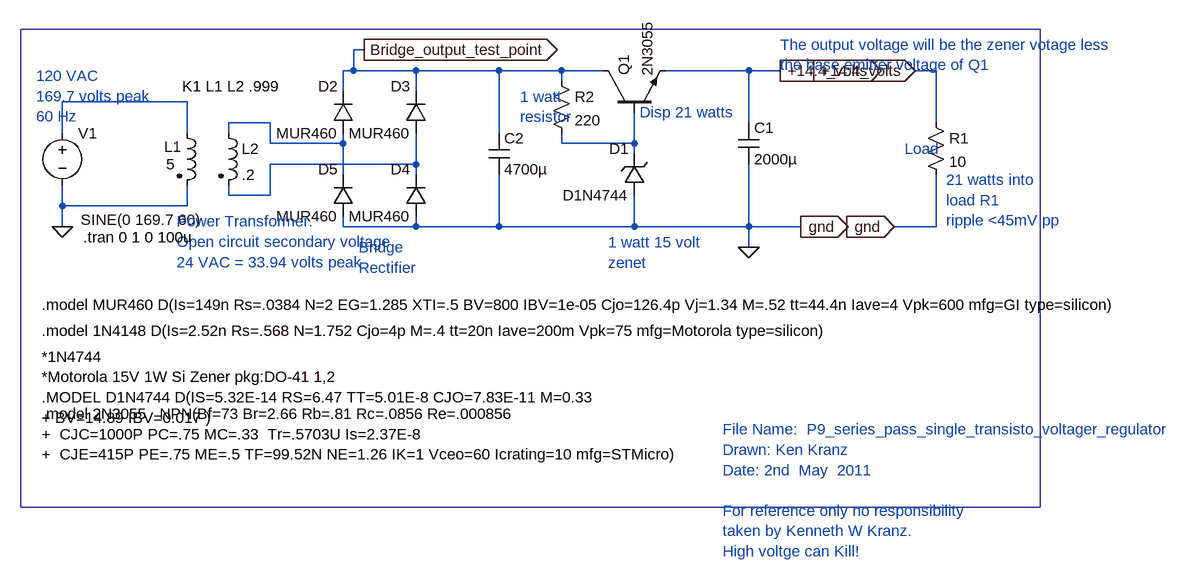
[diagram p0: schematic P9_Series_pass_single_transistor_regulator.asc]
P9_Series_pass_single_transistor_regulator.asc, the LTspice schematic file:
Version 4
SHEET 1 880 772
WIRE -1008 48 -1024 48
WIRE -1024 80 -1024 48
WIRE -1024 80 -1040 80
WIRE -928 80 -1024 80
WIRE -800 80 -928 80
WIRE -704 80 -800 80
WIRE -640 80 -704 80
WIRE -416 80 -544 80
WIRE -368 80 -416 80
WIRE -128 80 -160 80
WIRE -704 96 -704 80
WIRE -1040 112 -1040 80
WIRE -928 112 -928 80
WIRE -1280 128 -1472 128
WIRE -1152 160 -1216 160
WIRE -416 160 -416 80
WIRE -128 160 -128 80
WIRE -1472 176 -1472 128
WIRE -1280 176 -1280 128
WIRE -1216 176 -1216 160
WIRE -800 176 -800 80
WIRE -1152 192 -1152 160
WIRE -1040 192 -1040 176
WIRE -1040 192 -1152 192
WIRE -704 192 -704 176
WIRE -592 192 -592 144
WIRE -592 192 -704 192
WIRE -592 208 -592 192
WIRE -928 224 -928 176
WIRE -928 224 -1152 224
WIRE -1040 240 -1040 192
WIRE -928 240 -928 224
WIRE -1216 272 -1216 256
WIRE -1152 272 -1152 224
WIRE -1152 272 -1216 272
WIRE -1472 288 -1472 256
WIRE -1280 288 -1280 256
WIRE -1280 288 -1472 288
WIRE -1472 320 -1472 288
WIRE -1040 320 -1040 304
WIRE -928 320 -928 304
WIRE -928 320 -1040 320
WIRE -800 320 -800 240
WIRE -800 320 -928 320
WIRE -592 320 -592 272
WIRE -592 320 -800 320
WIRE -416 320 -416 224
WIRE -416 320 -592 320
WIRE -336 320 -416 320
WIRE -128 320 -128 240
WIRE -128 320 -192 320
WIRE -416 352 -416 320
FLAG -1472 320 0
FLAG -160 80 +14.4_volts
IOPIN -160 80 In
FLAG -368 80 +14.4_volts
IOPIN -368 80 Out
FLAG -416 352 0
FLAG -336 320 gnd
IOPIN -336 320 Out
FLAG -192 320 gnd
IOPIN -192 320 In
FLAG -1008 48 Bridge_output_test_point
IOPIN -1008 48 Out
SYMBOL ind2 -1296 160 R0
WINDOW 0 -19 37 Left 0
WINDOW 3 -16 64 Left 0
SYMATTR InstName L1
SYMATTR Value 5
SYMATTR Type ind
SYMATTR SpiceLine Rser=2
SYMBOL ind2 -1232 160 R0
SYMATTR InstName L2
SYMATTR Value .2
SYMATTR Type ind
SYMATTR SpiceLine Rser=.2
SYMBOL voltage -1472 160 R0
WINDOW 3 28 149 Left 0
WINDOW 123 0 0 Left 0
WINDOW 39 0 0 Left 0
SYMATTR Value SINE(0 169.7 60)
SYMATTR InstName V1
SYMBOL cap -432 160 R0
SYMATTR InstName C1
SYMATTR Value 2000µ
SYMBOL res -144 144 R0
SYMATTR InstName R1
SYMATTR Value 10
SYMATTR SpiceLine pwr=12
SYMBOL diode -1024 176 R180
WINDOW 0 24 72 Left 0
WINDOW 3 24 0 Left 0
SYMATTR InstName D2
SYMATTR Value MUR460
SYMBOL diode -912 176 R180
WINDOW 0 24 72 Left 0
WINDOW 3 24 0 Left 0
SYMATTR InstName D3
SYMATTR Value MUR460
SYMBOL diode -912 304 R180
WINDOW 0 24 72 Left 0
WINDOW 3 24 0 Left 0
SYMATTR InstName D4
SYMATTR Value MUR460
SYMBOL diode -1024 304 R180
WINDOW 0 24 72 Left 0
WINDOW 3 24 0 Left 0
SYMATTR InstName D5
SYMATTR Value MUR460
SYMBOL zener -576 272 R180
WINDOW 0 24 72 Left 0
WINDOW 3 24 0 Left 0
SYMATTR InstName D1
SYMATTR Value D1N4744
SYMATTR Description Diode
SYMATTR Type diode
SYMBOL npn -640 144 R270
SYMATTR InstName Q1
SYMATTR Value 2N3055
SYMBOL cap -816 176 R0
SYMATTR InstName C2
SYMATTR Value 4700µ
SYMBOL res -720 80 R0
SYMATTR InstName R2
SYMATTR Value 220
TEXT -456 632 Left 0 ;File Name:  P9_series_pass_single_transisto_voltager_regulator\nDrawn: Ken Kranz\nDate: 2nd  May  2011\n \nFor reference only no responsibility\ntaken by Kenneth W Kranz.\nHigh voltge can Kill!
TEXT -1512 88 Left 0 ;120 VAC\n169.7 volts peak\n60 Hz
TEXT -1296 312 Left 0 ;Power Transformer.\nOpen circuit secondary voltage\n24 VAC = 33.94 volts peak
TEXT -176 200 Left 0 ;Load
TEXT -1440 336 Left 0 !.tran 0 1 0 100u
TEXT -1288 104 Left 0 !K1 L1 L2 .999
TEXT -1016 352 Left 0 ;Bridge\nRectifier
TEXT -1504 440 Left 0 !.model MUR460 D(Is=149n Rs=.0384 N=2 EG=1.285 XTI=.5 BV=800 IBV=1e-05 Cjo=126.4p Vj=1.34 M=.52 tt=44.4n Iave=4 Vpk=600 mfg=GI type=silicon)
TEXT -1504 480 Left 0 !.model 1N4148 D(Is=2.52n Rs=.568 N=1.752 Cjo=4p M=.4 tt=20n Iave=200m Vpk=75 mfg=Motorola type=silicon)
TEXT -1504 520 Left 0 !*1N4744\n*Motorola 15V 1W Si Zener pkg:DO-41 1,2\n.MODEL D1N4744 D(IS=5.32E-14 RS=6.47 TT=5.01E-8 CJO=7.83E-11 M=0.33 \n+ BV=14.89 IBV=0.017 )
TEXT -632 344 Left 0 ;1 watt 15 volt\nzenet
TEXT -768 120 Left 0 ;1 watt\nresistor
TEXT -584 144 Left 0 ;Disp 21 watts
TEXT -368 40 Left 0 ;The output voltage will be the zener votage less\nthe base emitter voltage of Q1
TEXT -112 248 Left 0 ;21 watts into\nload R1\nripple <45mV pp
TEXT -1504 608 Left 0 !.model 2N3055   NPN(Bf=73 Br=2.66 Rb=.81 Rc=.0856 Re=.000856\n+  CJC=1000P PC=.75 MC=.33  Tr=.5703U Is=2.37E-8\n+  CJE=415P PE=.75 ME=.5 TF=99.52N NE=1.26 IK=1 Vceo=60 Icrating=10 mfg=STMicro)
RECTANGLE Normal 32 752 -1536 16

The netlist it stands for:
* P9_Series_pass_single_transistor_regulator.asc
L1 N001 0 5 Rser=2
L2 N002 N004 .2 Rser=.2
V1 N001 0 SINE(0 169.7 60)
C1 +14.4_volts 0 2000µ
R1 +14.4_volts 0 10 pwr=12
D2 N002 Bridge_output_test_point MUR460
D3 N004 Bridge_output_test_point MUR460
D4 0 N004 MUR460
D5 0 N002 MUR460
D1 0 N003 D1N4744
Q1 Bridge_output_test_point N003 +14.4_volts 0 2N3055
C2 Bridge_output_test_point 0 4700µ
R2 Bridge_output_test_point N003 220
.model D D
.lib standard.dio
.model NPN NPN
.model PNP PNP
.lib standard.bjt
* File Name:  P9_series_pass_single_transisto_voltager_regulator
* Drawn: Ken Kranz
* Date: 2nd  May  2011
* For reference only no responsibility
* taken by Kenneth W Kranz.
* High voltge can Kill!
* 120 VAC
* 169.7 volts peak
* 60 Hz
* Power Transformer.
* Open circuit secondary voltage
* 24 VAC = 33.94 volts peak
* Load
.tran 0 1 0 100u
K1 L1 L2 .999
* Bridge
* Rectifier
.model MUR460 D(Is=149n Rs=.0384 N=2 EG=1.285 XTI=.5 BV=800 IBV=1e-05 Cjo=126.4p Vj=1.34 M=.52 tt=44.4n Iave=4 Vpk=600 mfg=GI type=silicon)
.model 1N4148 D(Is=2.52n Rs=.568 N=1.752 Cjo=4p M=.4 tt=20n Iave=200m Vpk=75 mfg=Motorola type=silicon)
*1N4744
*Motorola 15V 1W Si Zener pkg:DO-41 1,2
.MODEL D1N4744 D(IS=5.32E-14 RS=6.47 TT=5.01E-8 CJO=7.83E-11 M=0.33
+ BV=14.89 IBV=0.017 )
* 1 watt 15 volt
* zenet
* 1 watt
* resistor
* Disp 21 watts
* The output voltage will be the zener votage less
* the base emitter voltage of Q1
* 21 watts into
* load R1
* ripple <45mV pp
.model 2N3055   NPN(Bf=73 Br=2.66 Rb=.81 Rc=.0856 Re=.000856
+  CJC=1000P PC=.75 MC=.33  Tr=.5703U Is=2.37E-8
+  CJE=415P PE=.75 ME=.5 TF=99.52N NE=1.26 IK=1 Vceo=60 Icrating=10 mfg=STMicro)
.backanno
.end